# Altium schematic sheet Revision_Changes.SchDoc: TE0706 - Changes list
size A4; Organization: Trenz Electronic GmbH; DocumentNumber: TE0706; Revision: 02; SheetNumber: 10; SheetTotal: 10; Date: 2016-06-28; Author: Vitali Tsiukala; DrawnBy: Vitali Tsiukala; Engineer: Vitali Tsiukala
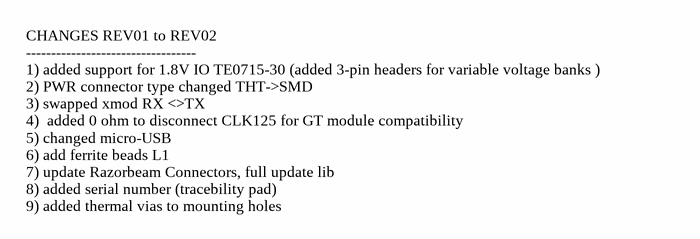
[diagram p0: Revision_Changes.SchDoc]

## Notes on the sheet
- CHANGES REV01 to REV02
  ----------------------------------
  1) added support for 1.8V IO TE0715-30 (added 3-pin headers for variable voltage banks )
  2) PWR connector type changed THT->SMD
  3) swapped xmod RX <>TX
  4)  added 0 ohm to disconnect CLK125 for GT module compatibility
  5) changed micro-USB
  6) add ferrite beads L1
  7) update Razorbeam Connectors, full update lib
  8) added serial number (tracebility pad)
  9) added thermal vias to mounting holes
- Title:
- Number:
- Rev.
- Date:
- A4
- Copyright:
- Page
- of
- Filename: